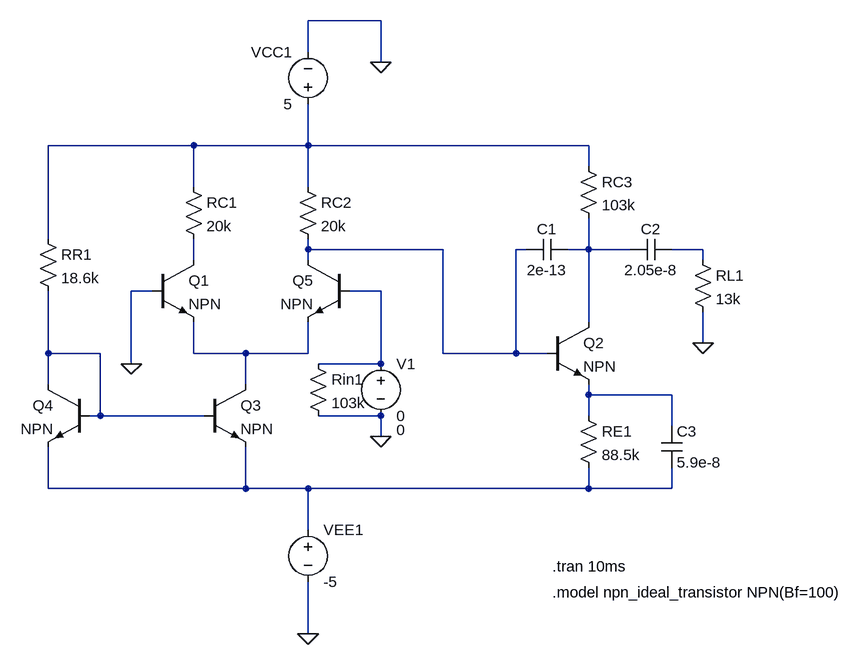
[diagram p0: schematic Draft1.asc]
Draft1.asc, the LTspice schematic file:
Version 4
SHEET 1 1332 912
WIRE 464 -48 352 -48
WIRE 352 0 352 -48
WIRE 464 16 464 -48
WIRE 176 144 -48 144
WIRE 352 144 352 80
WIRE 352 144 176 144
WIRE 784 144 352 144
WIRE 784 176 784 144
WIRE 176 208 176 144
WIRE 352 208 352 144
WIRE -48 288 -48 144
WIRE 352 304 352 288
WIRE 560 304 352 304
WIRE 688 304 672 304
WIRE 784 304 784 256
WIRE 784 304 752 304
WIRE 848 304 784 304
WIRE 960 304 912 304
WIRE 176 320 176 288
WIRE 352 320 352 304
WIRE 960 320 960 304
WIRE 112 368 80 368
WIRE 464 368 416 368
WIRE 784 416 784 304
WIRE 960 448 960 400
WIRE -48 464 -48 368
WIRE 32 464 -48 464
WIRE 176 464 176 416
WIRE 256 464 176 464
WIRE 352 464 352 416
WIRE 352 464 256 464
WIRE 560 464 560 304
WIRE 672 464 672 304
WIRE 672 464 560 464
WIRE 720 464 672 464
WIRE 80 480 80 368
WIRE 464 480 464 368
WIRE 464 480 368 480
WIRE -48 512 -48 464
WIRE 256 512 256 464
WIRE 784 528 784 512
WIRE 912 528 784 528
WIRE 32 560 32 464
WIRE 32 560 16 560
WIRE 192 560 32 560
WIRE 464 560 368 560
WIRE 784 560 784 528
WIRE 912 576 912 528
WIRE 464 592 464 560
WIRE -48 672 -48 608
WIRE 256 672 256 608
WIRE 256 672 -48 672
WIRE 352 672 256 672
WIRE 784 672 784 640
WIRE 784 672 352 672
WIRE 912 672 912 640
WIRE 912 672 784 672
WIRE 352 736 352 672
WIRE 352 896 352 816
FLAG 464 592 0
FLAG 960 448 0
FLAG 352 896 0
FLAG 464 16 0
FLAG 80 480 0
SYMBOL res 160 192 R0
SYMATTR InstName RC1
SYMATTR Value 20k
SYMBOL res 336 192 R0
SYMATTR InstName RC2
SYMATTR Value 20k
SYMBOL Res 768 544 R0
SYMATTR InstName RE1
SYMATTR Value 88.5k
SYMBOL Res -64 272 R0
SYMATTR InstName RR1
SYMATTR Value 18.6k
SYMBOL Res 768 160 R0
SYMATTR InstName RC3
SYMATTR Value 103k
SYMBOL npn 112 320 R0
SYMATTR InstName Q1
SYMBOL npn 720 416 R0
SYMATTR InstName Q2
SYMBOL npn 192 512 R0
SYMATTR InstName Q3
SYMBOL npn 16 512 M0
SYMATTR InstName Q4
SYMBOL npn 416 320 M0
SYMATTR InstName Q5
SYMBOL voltage 352 720 R0
SYMATTR InstName VEE1
SYMATTR Value -5
SYMBOL voltage 352 96 R180
WINDOW 0 24 96 Left 2
WINDOW 3 24 16 Left 2
SYMATTR InstName VCC1
SYMATTR Value 5
SYMBOL Res 944 304 R0
SYMATTR InstName RL1
SYMATTR Value 13k
SYMBOL Voltage 464 464 R0
WINDOW 123 24 118 Left 2
SYMATTR Value2 0
SYMATTR InstName V1
SYMATTR Value 0
SYMBOL cap 752 288 R90
WINDOW 0 0 32 VBottom 2
WINDOW 3 32 32 VTop 2
SYMATTR InstName C1
SYMATTR Value 2e-13
SYMBOL cap 912 288 R90
WINDOW 0 0 32 VBottom 2
WINDOW 3 32 32 VTop 2
SYMATTR InstName C2
SYMATTR Value 2.05e-8
SYMBOL cap 896 576 R0
SYMATTR InstName C3
SYMATTR Value 5.9e-8
SYMBOL Res 352 464 R0
SYMATTR InstName Rin1
SYMATTR Value 103k
TEXT 728 792 Left 2 !.tran 10ms
TEXT 728 832 Left 2 !.model npn_ideal_transistor NPN(Bf=100)

The netlist it stands for:
* Draft1.asc
RC1 N001 N005 20k
RC2 N001 N002 20k
RE1 N009 N010 88.5k
RR1 N001 N007 18.6k
RC3 N001 N003 103k
Q1 N005 0 N008 0 NPN
Q2 N003 N002 N009 0 NPN
Q3 N008 N007 N010 0 NPN
Q4 N007 N007 N010 0 NPN
Q5 N002 N006 N008 0 NPN
VEE1 N010 0 -5
VCC1 N001 0 5
RL1 N004 0 13k
V1 N006 0 0 0
C1 N003 N002 2e-13
C2 N004 N003 2.05e-8
C3 N009 N010 5.9e-8
Rin1 N006 0 103k
.model NPN NPN
.model PNP PNP
.lib standard.bjt
.tran 10ms
.model npn_ideal_transistor NPN(Bf=100)
.backanno
.end